# EasyEDA Pro project ProPrj_主控第一版_2024-07-22_15-28-46_2024-09-27.epro

# Schematic Schematic1
Board Name: Board1
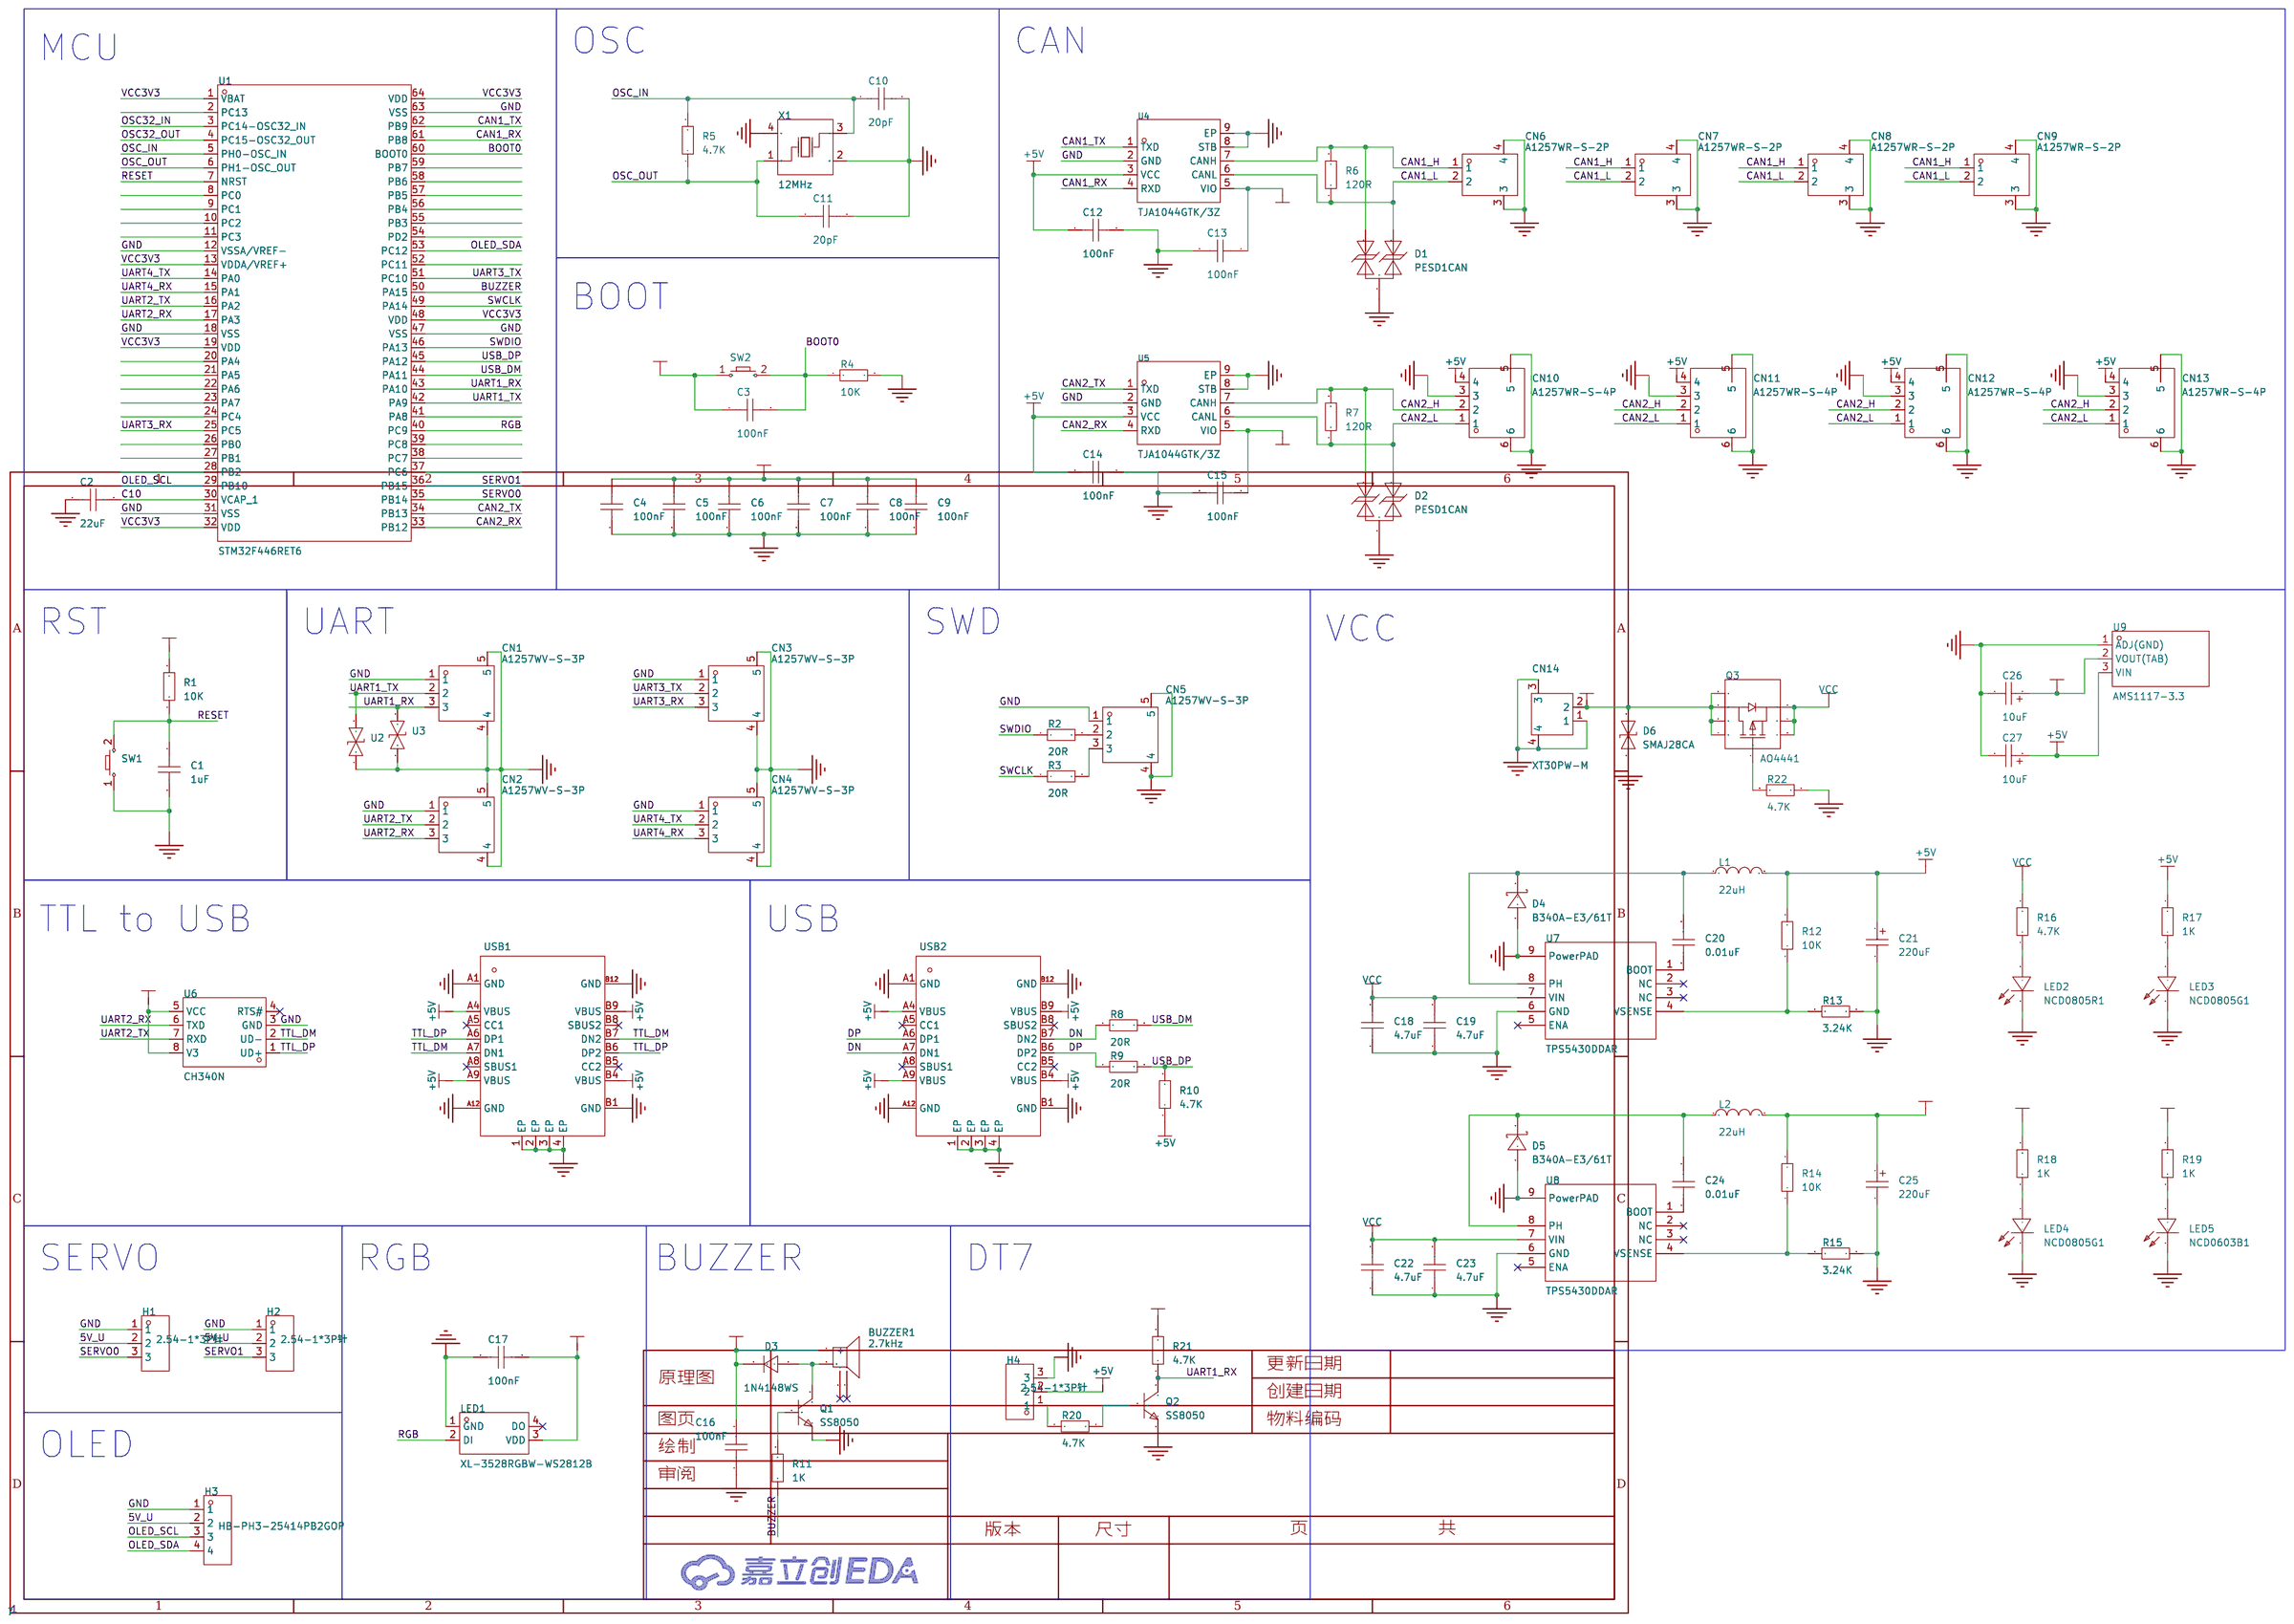
[diagram p0: schematic sheet]

## Parts
BUZZER1  2.7kHz  [BUZ-SMD_4P-L8.5-W8.5-P8.50-BR]
C1  1uF  [C0603]
C2  22uF  [C0603]
C3  100nF  [C0603]
C4  100nF  [C0603]
C5  100nF  [C0603]
C6  100nF  [C0603]
C7  100nF  [C0603]
C8  100nF  [C0603]
C9  100nF  [C0603]
C10  20pF  [C0603]
C11  20pF  [C0603]
C12  100nF  [C0603]
C13  100nF  [C0603]
C14  100nF  [C0603]
C15  100nF  [C0603]
C16  100nF  [C0603]
C17  100nF  [C0603]
C18  4.7uF  [C0603]
C19  4.7uF  [C0603]
C20  0.01uF  [C0603]
C21  220uF  [C_Ele_SMD_3x5.4mm]
C22  4.7uF  [C0603]
C23  4.7uF  [C0603]
C24  0.01uF  [C0603]
C25  220uF  [C_Ele_SMD_3x5.4mm]
C26  10uF  [C_Ele_SMD_3x5.4mm]
C27  10uF  [C_Ele_SMD_3x5.4mm]
CN1  A1257WV-S-3P  [CONN-SMD_A1257WV-S-3P]
CN2  A1257WV-S-3P  [CONN-SMD_A1257WV-S-3P]
CN3  A1257WV-S-3P  [CONN-SMD_A1257WV-S-3P]
CN4  A1257WV-S-3P  [CONN-SMD_A1257WV-S-3P]
CN5  A1257WV-S-3P  [CONN-SMD_A1257WV-S-3P]
CN6  A1257WR-S-2P  [CONN-SMD_A1257WR-S-2P]
CN7  A1257WR-S-2P  [CONN-SMD_A1257WR-S-2P]
CN8  A1257WR-S-2P  [CONN-SMD_A1257WR-S-2P]
CN9  A1257WR-S-2P  [CONN-SMD_A1257WR-S-2P]
CN10  A1257WR-S-4P  [CONN-SMD_A1257WR-S-4P]
CN11  A1257WR-S-4P  [CONN-SMD_A1257WR-S-4P]
CN12  A1257WR-S-4P  [CONN-SMD_A1257WR-S-4P]
CN13  A1257WR-S-4P  [CONN-SMD_A1257WR-S-4P]
CN14  XT30PW-M  [CONN-TH_XT30PW-M]
D1  PESD1CAN  [SOT-23-3_L2.9-W1.6-P1.90-LS2.8-BR]
D2  PESD1CAN  [SOT-23-3_L2.9-W1.6-P1.90-LS2.8-BR]
D3  1N4148WS  [SOD-323_L1.8-W1.3-LS2.5-RD]
D4  B340A-E3/61T  [SMA_L4.3-W2.6-LS5.2-RD]
D5  B340A-E3/61T  [SMA_L4.3-W2.6-LS5.2-RD]
D6  SMAJ28CA  [SMA_L4.4-W2.6-LS5.0-BI]
H1  2.54-1*3P针  [HDR-TH_3P-P2.54-V-M-1]
H2  2.54-1*3P针  [HDR-TH_3P-P2.54-V-M-1]
H3  HB-PH3-25414PB2GOP  [HDR-TH_4P-P2.54-V-M]
H4  2.54-1*3P针  [HDR-TH_3P-P2.54-V-M-1]
L1  22uH  [L0603]
L2  22uH  [L0603]
LED1  XL-3528RGBW-WS2812B  [LED-SMD_4P-L3.5-W2.8-BR-1]
LED2  NCD0805R1  [LED0805-R-RD]
LED3  NCD0805G1  [LED0805-R-RD]
LED4  NCD0805G1  [LED0805-R-RD]
LED5  NCD0603B1  [LED0603-RD]
Q1  SS8050  [SOT-23-3_L2.9-W1.3-P1.90-LS2.4-BR]
Q2  SS8050  [SOT-23-3_L2.9-W1.3-P1.90-LS2.4-BR]
Q3  AO4441  [SOIC-8_L4.9-W3.9-P1.27-LS6.0-BL]
R1  10K  [R0603]
R2  20R  [R0603]
R3  20R  [R0603]
R4  10K  [R0603]
R5  4.7K  [R0603]
R6  120R  [R0603]
R7  120R  [R0603]
R8  20R  [R0603]
R9  20R  [R0603]
R10  4.7K  [R0603]
R11  1K  [R0603]
R12  10K  [R0603]
R13  3.24K  [R0603]
R14  10K  [R0603]
R15  3.24K  [R0603]
R16  4.7K  [R0603]
R17  1K  [R0603]
R18  1K  [R0603]
R19  1K  [R0603]
R20  4.7K  [R0603]
R21  4.7K  [R0603]
R22  4.7K  [R0603]
SW1  -  [Key_SMD_3x4x2]
SW2  -  [Key_SMD_3x4x2]
U1  STM32F446RET6  [LQFP-64_L10.0-W10.0-P0.50-LS12.0-BL]
U2  ESD9B5.0ST5G  [SOD-923_L0.8-W0.6-LS1.0-BI]
U3  ESD9B5.0ST5G  [SOD-923_L0.8-W0.6-LS1.0-BI]
U4  TJA1044GTK/3Z  [HVSON-8_L3.0-W3.0-P0.65-BL-EP]
U5  TJA1044GTK/3Z  [HVSON-8_L3.0-W3.0-P0.65-BL-EP]
U6  CH340N  [SOP-8_L4.9-W3.9-P1.27-LS6.0-BL]
U7  TPS5430DDAR  [ESOP-8_L4.9-W3.9-P1.27-LS6.0-TL-EP]
U8  TPS5430DDAR  [ESOP-8_L4.9-W3.9-P1.27-LS6.0-TL-EP]
U9  AMS1117-3.3  [SOT-89_L4.5-W2.5-P1.50-LS4.2-BR]
USB1  -  [USB_TYPE-C-16P]
USB2  -  [USB_TYPE-C-16P]
X1  12MHz  [OSC-SMD_4P-L3.2-W2.5-BL]

## Library data of the parts
BUZZER1 = MLT-8530_C94599: 驱动方式:无源(外部驱动);构造类型:电磁式;频率:2.7kHz;声压(SPL):80dB@5V,10cm;; LCSC Part Name: MLT-8530; Supplier Part: C94599; Manufacturer: 华能; Manufacturer Part: MLT-8530; Supplier Footprint: SMD,8.5x8.5mm; JLCPCB Part Class: 扩展库; Datasheet: https://atta.szlcsc.com/upload/public/pdf/source/20170522/1495448322339.pdf; Supplier: LCSC; Oscillator Circuit: 无源(外部驱动); Technology Type: 电磁式; Operating Voltage: 2.5V~4.5V; Sound Pressure Level (SPL): 80dB@5V,10cm; Length: 8.5mm; Width: 8.5mm; Height: 3.3mm
C1-C20 C22-C24 = CAP_0603: Supplier Footprint: 0603
C21 C25-C27 = C_Ele_SMD_3x5.4mm: Supplier Footprint: SMD,3x5.4mm
CN1-CN5 = A1257WV-S-3P: 插针结构:1x3P;间距:1.25mm;安装方式:-;参考系列:GH;总PIN数:3P;排数:1;每排PIN数:3;行距:-;触头材质:黄铜;; LCSC Part Name: 系列:GH 间距:1.25mm 1x3P; Supplier Part: C225119; Manufacturer: CJT(长江连接器); Supplier Footprint: SMD,P=1.25mm; JLCPCB Part Class: 扩展库; Datasheet: https://atta.szlcsc.com/upload/public/pdf/source/20181008/C272994_C9E89FA8A36D0009CAD30AD8C59C2782.pdf; Supplier: LCSC; Pins Structure: 1x3P; Pitch: 1.25mm; Reference Series: GH; Number of Pins: 3P; Number of Rows: 1; Number of PINs Per Row: 3; Contact Material: 黄铜
CN6-CN9 = A1257WR-S-2P: 插针结构:1x2P;间距:1.25mm;安装方式:-;参考系列:GH;总PIN数:2P;排数:1;每排PIN数:2;行距:-;触头材质:黄铜;; LCSC Part Name: 系列:GH 间距:1.25mm 1x2P; Supplier Part: C225125; Manufacturer: CJT(长江连接器); Supplier Footprint: SMD,P=1.25mm,卧贴; JLCPCB Part Class: 扩展库; Datasheet: https://atta.szlcsc.com/upload/public/pdf/source/20181008/C272994_C9E89FA8A36D0009CAD30AD8C59C2782.pdf; Supplier: LCSC; Pins Structure: 1x2P; Pitch: 1.25mm; Reference Series: GH; Number of Pins: 2P; Number of Rows: 1; Number of PINs Per Row: 2; Contact Material: 黄铜
CN10-CN13 = A1257WR-S-4P: 插针结构:1x4P;间距:1.25mm;安装方式:-;参考系列:GH;总PIN数:4P;排数:1;每排PIN数:4;行距:-;触头材质:黄铜;; LCSC Part Name: 系列:GH 间距:1.25mm 1x4P; Supplier Part: C225127; Manufacturer: CJT(长江连接器); Supplier Footprint: SMD,P=1.25mm,卧贴; JLCPCB Part Class: 扩展库; Datasheet: https://atta.szlcsc.com/upload/public/pdf/source/20181008/C272994_C9E89FA8A36D0009CAD30AD8C59C2782.pdf; Supplier: LCSC; Pins Structure: 1x4P; Pitch: 1.25mm; Reference Series: GH; Number of Pins: 4P; Number of Rows: 1; Number of PINs Per Row: 4; Contact Material: 黄铜
CN14 = XT30PW-M: 类别:-;类型1:-;; LCSC Part Name: AMASS(艾迈斯)航模插头 卧式弯脚 XT30PW-M公头; Supplier Part: C431092; Manufacturer: AMASS(艾迈斯); JLCPCB Part Class: 扩展库; Datasheet: https://atta.szlcsc.com/upload/public/pdf/source/20220222/6A9F22F7850E25B33E1BE430ADF8560B.pdf; Supplier: LCSC; Brand: 艾迈斯; Type: 航模插头; RatedVoltage: DC 500V; InterfaceType: 公头; RatedCurrent: 15A; RecommendedWireGauge: 16/18/20AWG; contact resistance: 1.2mΩ; specifications: 2pin
D1 D2 = PESD1CAN_C343993: 极性:双向;反向截止电压(Vrwm):24V;最大钳位电压:48V;峰值脉冲电流(Ipp)@10/1000us:6A;击穿电压:26.7V;; LCSC Part Name: 双向ESD; Supplier Part: C343993; Manufacturer: BORN(伯恩半导体); Supplier Footprint: SOT-23; JLCPCB Part Class: 扩展库; Datasheet: https://atta.szlcsc.com/upload/public/pdf/source/20181211/C343993_AF595724ADB82F42A1C256C97FD7AD6B.pdf; Supplier: LCSC; polarity: 双向; Reverse Stand-Off Voltage (Vrwm): 24V; Maximum Clamping Voltage: 48V; Peak Pulse Current (Ipp)@10/1000us: 6A; Breakdown Voltage: 26.7V; Type: ESD
D3 = 1N4148WS_C2128: 二极管配置:独立式;正向压降(Vf):1.25V@150mA;直流反向耐压(Vr):100V;平均整流电流(Io):150mA;功率:200mW;反向恢复时间(trr):4ns;; LCSC Part Name: 电压:100V 电流:150mA; Supplier Part: C2128; Manufacturer: CJ(江苏长电/长晶); Supplier Footprint: SOD-323; JLCPCB Part Class: 基础库; Datasheet: https://atta.szlcsc.com/upload/public/pdf/source/20140809/1457707208178.pdf; Supplier: LCSC; Diode Configuration: 独立式; Forward Voltage (Vf@If): 1.25V@150mA; Reverse Voltage (Vr): 100V; Average Rectified Current (Io): 150mA; Power Dissipation: 200mW; Reverse Leakage Current: 1uA@75V; Reverse Recovery Time (trr): 4ns
D4 D5 = B340A-E3/61T: 正向压降(Vf):550mV@3A;直流反向耐压(Vr):40V;平均整流电流(Io):3A;; LCSC Part Name: 电压:40V 电流:3A; Supplier Part: C15570; Manufacturer: VISHAY(威世); Supplier Footprint: SMA(DO-214AC); JLCPCB Part Class: 扩展库; Datasheet: https://atta.szlcsc.com/upload/public/pdf/source/20130720/1457706624701.pdf; Supplier: LCSC; Forward Voltage (Vf@If): 550mV@3A; Reverse Voltage (Vr): 40V; Average Rectified Current (Io): 3A; Reverse Leakage Current (Ir): 500uA@40V
D6 = SMAJ28CA_C148228: 反向截止电压(Vrwm):28V;最大钳位电压:45.4V;峰值脉冲电流(Ipp)@10/1000us:8.8A;峰值脉冲功率(Ppp)@10/1000us:400W;击穿电压:31.1V;; LCSC Part Name: 双向TVS 28V截止 8.8A峰值脉冲; Supplier Part: C148228; Manufacturer: Littelfuse(美国力特); Supplier Footprint: SMA(DO-214AC); JLCPCB Part Class: 扩展库; Datasheet: https://atta.szlcsc.com/upload/public/pdf/source/20190402/C374025_5ACE77BC72947DF13CF0CBC7F8B57228.pdf; Supplier: LCSC; Reverse Stand-Off Voltage (Vrwm): 28V; Maximum Clamping Voltage: 45.4V; Peak Pulse Current (Ipp)@10/1000us: 8.8A; Peak Pulse Power Dissipation (Ppp)@10/1000us: 400W; Breakdown Voltage: 31.1V; Type: TVS
H1 H2 H4 = 2.54-1*3P针: 插针结构:1x3P;间距:2.54mm;行距:-;圆针/方针:方针;安装类型:直插;排数:单排;总PIN位数:3P;额定电流:3A;额定电压:-;配合针长度:-;塑高:-;端接针长度:-;触头材质:-;触头镀层:-;工作温度范围:-40℃~+105℃;颜色:黑色;; LCSC Part Name: 间距:2.54mm 1x3P 直插 方针; Supplier Part: C49257; Manufacturer: BOOMELE(博穆精密); Supplier Footprint: 插件,P=2.54mm; JLCPCB Part Class: Extended Part; Datasheet: https://atta.szlcsc.com/upload/public/pdf/source/20221018/3E9408392E35E6F57A28985E5F7BF5C9.pdf; Supplier: LCSC; Pin Structure: 1x3P; Pitch: 2.54mm; Circluar Pins/Square Pins: 方针; Mounting Type: 直插; Number of Rows: 单排; Number of Pins: 3P; Current Rating (Max): 3A; Operating Temperature Range: -40℃~+105℃; Color: 黑色
H3 = HB-PH3-25414PB2GOP: 插针结构:1x4P;间距:2.54mm;行距:2.54mm;圆针/方针:方针;安装类型:直插;排数:单排;总PIN位数:4P;额定电流:3A;额定电压:250V;配合针长度:6mm;塑高:2.54mm;端接针长度:3mm;触头材质:黄铜;触头镀层:金;工作温度范围:-40℃~+105℃;焊接温度(最大值):260℃;颜色:黑色;; LCSC Part Name: 间距:2.54mm 1x4P 直插 方针; Supplier Part: C6332197; Manufacturer: HANBO(汉博); Supplier Footprint: 插件,P=2.54mm; JLCPCB Part Class: Extended Part; Datasheet: https://atta.szlcsc.com/upload/public/pdf/source/20230803/F72D259687963761DF1B552F3BB84A31.pdf; Supplier: LCSC; Pin Structure: 1x4P; Pitch: 2.54mm; Row Spacing: 2.54mm; Circluar Pins/Square Pins: 方针; Mounting Type: 直插; Number of Rows: 单排; Number of Pins: 4P; Current Rating (Max): 3A; Voltage Rating (Max): 250V; Length of Mating Pin: 6mm; Insulation Height: 2.54mm; Length of End Connection Pin: 3mm; Contact Material: 黄铜; Contact Plating: 金; Operating Temperature Range: -40℃~+105℃; Soldering Temperature(Max): 260℃; Color: 黑色
L1 L2 = L_0603
LED1 = XL-3528RGBW-WS2812B: 3528 七彩幻彩雾状 ws2812B 内置驱动IC; Supplier Part: C2890364; Manufacturer: XINGLIGHT(成兴光); Supplier Footprint: SMD3528-4P; JLCPCB Part Class: 扩展库; Datasheet: https://atta.szlcsc.com/upload/public/pdf/source/20240218/041E1E0D0024617DFFF124D9C311BB4D.pdf; Supplier: LCSC
LED2 = NCD0805R1: 灯头类型:-;发光颜色:红色;正向电压(VF):1.6V~2.6V;功率:65mW;正向电流:20mA;主波长:615nm~630nm;二极管配置:独立二极管;透镜颜色:无色透明透镜;色温:-;发光强度:67mcd~195mcd;发光角度:130°;载带方式:-;工作温度:-30℃~+85℃;; Supplier Part: C84256; Manufacturer: 国星光电; Supplier Footprint: 0805; JLCPCB Part Class: 基础库; Datasheet: https://atta.szlcsc.com/upload/public/pdf/source/20200820/C84256_F0A75A43B3EAD75808600A0514C76B99.pdf; Supplier: LCSC; Emitted Color: 红色; Forward Voltage (VF): 1.6V~2.6V; Power Dissipation: 65mW; Forward Current: 20mA; Dominant Wavelength: 615nm~630nm; Diode Configuration: 独立二极管; Lens Color: 无色透明透镜; Luminous Intensity: 67mcd~195mcd; Viewing Angle: 130°; Operating Temperature: -30℃~+85℃
LED3 LED4 = NCD0805G1: 发光颜色:翠绿色;正向电压(VF):2.5V~3.6V;功率:72mW;正向电流:5mA;主波长:525nm~537.5nm;透镜颜色:无色透明透镜;发光强度:180mcd~400mcd;发光角度:130°;工作温度:-30℃~+85℃;; Supplier Part: C84260; Manufacturer: 国星光电; Supplier Footprint: 0805; JLCPCB Part Class: Extended Part; Datasheet: https://atta.szlcsc.com/upload/public/pdf/source/20200820/C84260_AFC7BF57C6FBA034D182BB8D10A67EFE.pdf; Supplier: LCSC; Emitted Color: 翠绿色; Forward Voltage (VF): 2.5V~3.6V; Power Dissipation: 72mW; Forward Current: 5mA; Dominant Wavelength: 525nm~537.5nm; Lens Color: 无色透明透镜; Luminous Intensity: 180mcd~400mcd; Viewing Angle: 130°; Operating Temperature: -30℃~+85℃; Diode Configuration: 独立二极管
LED5 = NCD0603B1: 发光颜色:蓝色;正向电压(VF):2.6V~3.6V;功率:72mW;正向电流:10mA;主波长:463nm~475nm;透镜颜色:无色透明透镜;发光强度:80mcd~220mcd;发光角度:130°;工作温度:-30℃~+85℃;; Supplier Part: C84266; Manufacturer: 国星光电; Supplier Footprint: 0603; JLCPCB Part Class: Extended Part; Datasheet: https://atta.szlcsc.com/upload/public/pdf/source/20200820/C84266_6A3CDBEFA72C6CAD68EDA53474ADAE6C.pdf; Supplier: LCSC; Emitted Color: 蓝色; Forward Voltage (VF): 2.6V~3.6V; Power Dissipation: 72mW; Forward Current: 10mA; Dominant Wavelength: 463nm~475nm; Lens Color: 无色透明透镜; Luminous Intensity: 80mcd~220mcd; Viewing Angle: 130°; Operating Temperature: -30℃~+85℃; Diode Configuration: 独立二极管
Q1 Q2 = SS8050_C2150: 晶体管类型:NPN;集电极电流(Ic):1.5A;集射极击穿电压(Vceo):25V;功率(Pd):300mW;直流电流增益(hFE@Ic,Vce):200@100mA,1V;; LCSC Part Name: SS8050(RANGE:200-350) hfe=200~350; Supplier Part: C2150; Manufacturer: CJ(江苏长电/长晶); Supplier Footprint: SOT-23; JLCPCB Part Class: 基础库; Datasheet: https://atta.szlcsc.com/upload/public/pdf/source/20230322/AEE86F4B043774EFF80CAEA14A37D9E9.pdf; Supplier: LCSC; Transistor Type: NPN; Collector Current (Ic): 1.5A; Collector-Emitter Breakdown Voltage (Vceo): 25V; Power Dissipation (Pd): 300mW; DC Current Gain (hFE@Ic,Vce): 200@100mA,1V; Transition Frequency (fT): 100MHz; Collector Cut-Off Current (Icbo): 100nA; Collector-Emitter Saturation Voltage (VCE(sat)@Ic,Ib): 500mV@800mA,80mA
Q3 = AO4441_C22199: 类型:P沟道;漏源电压(Vdss):60V;连续漏极电流(Id):4A;功率(Pd):3.1W;导通电阻(RDS(on)@Vgs,Id):100mΩ@10V,4A;阈值电压(Vgs(th)@Id):3V@250uA;; LCSC Part Name: P沟道 耐压:60V 电流:4A; Supplier Part: C22199; Manufacturer: AOS; Supplier Footprint: SOIC-8; JLCPCB Part Class: 扩展库; Datasheet: https://atta.szlcsc.com/upload/public/pdf/source/20150518/1457707310050.pdf; Supplier: LCSC; Type: P沟道; Drain Source Voltage (Vdss): 60V; Continuous Drain Current (Id): 4A; Power Dissipation (Pd): 3.1W; Drain Source On Resistance (RDS(on)@Vgs,Id): 100mΩ@10V,4A; Gate Threshold Voltage (Vgs(th)@Id): 3V@250uA; Total Gate Charge (Qg@Vgs): 20nC@10V; Input Capacitance (Ciss@Vds): 1.12nF@30V; Operating Temperature: -55℃~+150℃@(Tj)
R1-R22 = Res_0603: Supplier Footprint: 0603
SW1 SW2 = Key_SMD_3x4x2: Supplier Footprint: SMD
U1 = STM32F446RET6: CPU内核:CM4;程序存储容量:512KB;RAM总容量:128KB;GPIO端口数量:50;工作电压范围:1.7V~3.6V;CPU最大主频:180MHz;程序存储器类型:FLASH;; LCSC Part Name: STM32F446RET6 MSL=3; Supplier Part: C69336; Manufacturer: ST(意法半导体); Supplier Footprint: LQFP-64(10x10); JLCPCB Part Class: 扩展库; Datasheet: https://atta.szlcsc.com/upload/public/pdf/source/20170518/1495086068896.pdf; Supplier: LCSC; CPU Core: CM4; Program Storage Size: 512KB; RAM Size: 128KB; GPIO Ports Number: 50; Operating Voltage Range: 1.7V~3.6V; CPU Maximum Speed: 180MHz; Program Memory Type: FLASH; Operating Temperature Range: -40℃~+85℃; ADC (Bit): 12bit; DAC (Bit): 12bit; Universal Serial Bus: 有; Peripheral/Function: PWM；PWM；低电压检测; Watchdog: 有; Infrared Data Association: 有; Low-Voltage Detect: 有; Direct Memory Access: 有; Internal Oscillator: 有
U2 U3 = ESD9B5.0ST5G_C3021104: Supplier Part: C3021104; Manufacturer: TECH PUBLIC(台舟); Supplier Footprint: SOD-923; JLCPCB Part Class: 扩展库; Datasheet: https://atta.szlcsc.com/upload/public/pdf/source/20220524/6CC5EA9A5BA15BBB56040E503B840966.pdf; Supplier: LCSC
U4 U5 = TJA1044GTK/3Z: 类型:-;; Supplier Part: C2157795; Manufacturer: NXP(恩智浦); Supplier Footprint: HVSON-8-EP(3x3); JLCPCB Part Class: 扩展库; Datasheet: https://atta.szlcsc.com/upload/public/pdf/source/20180227/C181725_15196977259441370130.pdf; Supplier: LCSC
U6 = CH340N: LCSC Part Name: USB转串口芯片 CH340; Supplier Part: C2977777; Manufacturer: WCH(南京沁恒); Supplier Footprint: SOP-8; JLCPCB Part Class: 扩展库; Datasheet: https://atta.szlcsc.com/upload/public/pdf/source/20230530/6E401E9554E9F5311886CC8B3F89B62E.pdf; Supplier: LCSC
U7 U8 = TPS5430DDAR: 功能类型:降压型;输出类型:可调;输入电压:5.5V~36V;输出电压:1.221V~32.04V;输出电流(最大值):3A;; LCSC Part Name: 降压 3A 36V; Supplier Part: C9864; Manufacturer: TI(德州仪器); Supplier Footprint: SOIC-8-EP; JLCPCB Part Class: 基础库; Datasheet: https://www.ti.com/cn/lit/gpn/tps5430; Supplier: LCSC; Function: 降压型; Output Type: 可调; Input Voltage: 5.5V~36V; Output Voltage: 1.221V~32.04V; Output Current (Max): 3A; Switching Frequency: 500kHz; Operating Temperature: -40℃~+125℃@(TJ); Synchronous Rectification: 否; Number of Outputs: 1; Topology: 降压式; Switch tube (built-in/external): 内置
U9 = AMS1117-3.3_C347256: 输出类型:固定;最大输入电压:12V;输出电压:3.3V;最大输出电流:1A;电源纹波抑制比(PSRR):60dB@(120Hz);输出极性:正极;; LCSC Part Name: 输出:3.3V 电流:1A 耐压:12V; Supplier Part: C347256; Manufacturer: UMW(友台半导体); Supplier Footprint: SOT-89; JLCPCB Part Class: 扩展库; Datasheet: https://atta.szlcsc.com/upload/public/pdf/source/20231109/155D79A26D9DB04352555A58D5969DC8.pdf; Supplier: LCSC; Output Type: 固定; Maximum Input Voltage: 12V; Output Voltage: 3.3V; MAX Output Current: 1A; Power Supply Rejection Ratio (PSRR): 60dB@(120Hz); Dropout Voltage: 1.3V@(1A); Output Polarity: 正极; Number of Outputs: 1
USB1 USB2 = USB_TYPE-C-16P: Supplier Footprint: SMD
X1 = X322512MSB4SI: 晶振类型:贴片晶振;频率:12MHz;常温频差:±10ppm;外接负载电容:20pF;频率稳定度(全温):±20ppm;; LCSC Part Name: 12MHz ±10ppm 20pF; Supplier Part: C9002; Manufacturer: YXC(扬兴晶振); Supplier Footprint: SMD3225-4P; JLCPCB Part Class: 基础库; Datasheet: https://atta.szlcsc.com/upload/public/pdf/source/20240329/19D5F850207469550BEB00D7DFEDBC7A.pdf; Supplier: LCSC; Crystal Type: 贴片晶振; Normal temperature Frequency Tolerance: ±10ppm; External load capacitor: 20pF; Frequency Stability(Full temperature range): ±20ppm; Operating Temperature: -40℃~+85℃

## Nets
5V_U: C25.1 H1.2 H2.2 H3.2 L2.2 R14.2 R18.2
+5V: C12.2 C14.2 C21.1 C27.1 CN10.4 CN11.4 CN12.4 CN13.4 H4.2 L1.2 R10.1 R12.2 R17.2 U4.3(VCC) U5.3(VCC) U9.3(VIN) USB1.A4(VBUS) USB1.A9(VBUS) USB1.B4(VBUS) USB1.B9(VBUS) USB2.A4(VBUS) USB2.A9(VBUS) USB2.B4(VBUS) USB2.B9(VBUS)
GND: C1.2 C2.1 C4.1 C5.1 C6.1 C7.1 C8.1 C9.1 C10.2 C11.2 C12.1 C13.2 C14.1 C15.2 C16.1 C17.1 C18.1 C19.1 C21.2 C22.1 C23.1 C25.2 C26.2 C27.2 CN1.1 CN1.4 CN1.5 CN2.1 CN2.4 CN2.5 CN3.1 CN3.4 CN3.5 CN4.1 CN4.4 CN4.5 CN5.1 CN5.4 CN5.5 CN6.3 CN6.4 CN7.3 CN7.4 CN8.3 CN8.4 CN9.3 CN9.4 CN10.3 CN10.5 CN10.6 CN11.3 CN11.5 CN11.6 CN12.3 CN12.5 CN12.6 CN13.3 CN13.5 CN13.6 CN14.1 CN14.3 CN14.4 D1.3(A) D2.3(A) D4.2(A) D5.2(A) D6.1 H1.1 H2.1 H3.1 H4.3 LED1.1(GND) LED2.2(-) LED3.2(-) LED4.2(-) LED5.2(-) Q1.2(E) Q2.2(E) R4.2 R13.1 R15.1 R22.1 SW1.1 U1.12(VSSA/VREF-) U1.18(VSS) U1.31(VSS) U1.47(VSS) U1.63(VSS) U2.1 U3.1 U4.2(GND) U4.8(STB) U4.9(EP) U5.2(GND) U5.8(STB) U5.9(EP) U6.3(GND) U7.6(GND) U7.9(PowerPAD) U8.6(GND) U8.9(PowerPAD) U9.1(ADJ(GND)) USB1.1(EP) USB1.2(EP) USB1.3(EP) USB1.4(EP) USB1.A1(GND) USB1.A12(GND) USB1.B1(GND) USB1.B12(GND) USB2.1(EP) USB2.2(EP) USB2.3(EP) USB2.4(EP) USB2.A1(GND) USB2.A12(GND) USB2.B1(GND) USB2.B12(GND) X1.2(GND) X1.4(GND)
VCC: C18.2 C19.2 C22.2 C23.2 Q3.1(S) Q3.2(S) Q3.3(S) R16.2 U7.7(VIN) U8.7(VIN)
VCC3V3: BUZZER1.1(+) C3.1 C4.2 C5.2 C6.2 C7.2 C8.2 C9.2 C13.1 C15.1 C16.2 C17.2 C26.1 D3.1(K) LED1.3(VDD) R1.2 R19.2 R21.2 SW2.1 U1.1(VBAT) U1.13(VDDA/VREF+) U1.19(VDD) U1.32(VDD) U1.48(VDD) U1.64(VDD) U4.5(VIO) U5.5(VIO) U6.5(VCC) U6.8(V3) U9.2(VOUT(TAB))
BAT: CN14.2 D6.2 Q3.5(D) Q3.6(D) Q3.7(D) Q3.8(D)
BOOT0: C3.2 R4.1 SW2.2 U1.60(BOOT0)
BUZZER: R11.1 U1.50(PA15)
C10: C2.2 U1.30(VCAP_1)
CAN1_H: CN6.1 CN7.1 CN8.1 CN9.1 D1.2(K) R6.2 U4.7(CANH)
CAN1_L: CN6.2 CN7.2 CN8.2 CN9.2 D1.1(K) R6.1 U4.6(CANL)
CAN1_RX: U1.61(PB8) U4.4(RXD)
CAN1_TX: U1.62(PB9) U4.1(TXD)
CAN2_H: CN10.2 CN11.2 CN12.2 CN13.2 D2.2(K) R7.2 U5.7(CANH)
CAN2_L: CN10.1 CN11.1 CN12.1 CN13.1 D2.1(K) R7.1 U5.6(CANL)
CAN2_RX: U1.33(PB12) U5.4(RXD)
CAN2_TX: U1.34(PB13) U5.1(TXD)
DN: R8.1 USB2.A7(DN1) USB2.B7(DN2)
DP: R9.1 USB2.A6(DP1) USB2.B6(DP2)
OLED_SCL: H3.3 U1.29(PB10)
OLED_SDA: H3.4 U1.53(PC12)
OSC32_IN: U1.3(PC14-OSC32_IN)
OSC32_OUT: U1.4(PC15-OSC32_OUT)
OSC_IN: C10.1 R5.2 U1.5(PH0-OSC_IN) X1.3(OSC2)
OSC_OUT: C11.1 R5.1 U1.6(PH1-OSC_OUT) X1.1(OSC1)
RESET: C1.1 R1.1 SW1.2 U1.7(NRST)
RGB: LED1.2(DI) U1.40(PC9)
SERVO0: H1.3 U1.35(PB14)
SERVO1: H2.3 U1.36(PB15)
SWCLK: R3.1 U1.49(PA14)
SWDIO: R2.1 U1.46(PA13)
TTL_DM: U6.2(UD-) USB1.A7(DN1) USB1.B7(DN2)
TTL_DP: U6.1(UD+) USB1.A6(DP1) USB1.B6(DP2)
UART1_RX: CN1.3 Q2.3(C) R21.1 U1.43(PA10) U3.2
UART1_TX: CN1.2 U1.42(PA9) U2.2
UART2_RX: CN2.3 U1.17(PA3) U6.6(TXD)
UART2_TX: CN2.2 U1.16(PA2) U6.7(RXD)
UART3_RX: CN3.3 U1.25(PC5)
UART3_TX: CN3.2 U1.51(PC10)
UART4_RX: CN4.3 U1.15(PA1)
UART4_TX: CN4.2 U1.14(PA0)
USB_DM: R8.2 U1.44(PA11)
USB_DP: R9.2 R10.2 U1.45(PA12)
$1N8795: BUZZER1.2 D3.2(A) Q1.3(C)
$1N9041: Q1.1(B) R11.2
$1N16702: C20.1 U7.1(BOOT)
$1N16722: C20.2 D4.1(K) L1.1 U7.8(PH)
$1N17094: R12.1 R13.2 U7.4(VSENSE)
$1N17486: C24.1 U8.1(BOOT)
$1N17488: C24.2 D5.1(K) L2.1 U8.8(PH)
$1N17512: R14.1 R15.2 U8.4(VSENSE)
$1N17679: LED2.1(+) R16.1
$1N17858: LED3.1(+) R17.1
$1N20132: LED4.1(+) R18.1
$1N20230: LED5.1(+) R19.1
$1N21122: Q2.1(B) R20.2
$1N21124: H4.1 R20.1
$1N24808: Q3.4(G) R22.2
Net-(CN5-2): CN5.2 R2.2
Net-(CN5-3): CN5.3 R3.2

Not connected (* = marked no-connect by the designer): BUZZER1 3* 4*; LED1 4(DO)*; U1 2(PC13) 8(PC0) 9(PC1) 10(PC2) 11(PC3) 20(PA4) 21(PA5) 22(PA6) 23(PA7) 24(PC4) 26(PB0) 27(PB1) 28(PB2) 37(PC6) 38(PC7) 39(PC8) 41(PA8) 52(PC11) 54(PD2) 55(PB3) 56(PB4) 57(PB5) 58(PB6) 59(PB7); U6 4(RTS#)*; U7 2(NC)* 3(NC)* 5(ENA)*; U8 2(NC)* 3(NC)* 5(ENA)*; USB1 A5(CC1)* A8(SBUS1)* B5(CC2)* B8(SBUS2)*; USB2 A5(CC1)* A8(SBUS1)* B5(CC2)* B8(SBUS2)*

## Notes on the sheet
- MCU
- OSC
- CAN
- BOOT
- RST
- UART
- SWD
- VCC
- TTL to USB
- USB
- SERVO
- RGB
- BUZZER
- DT7
- OLED

# Board PCB1
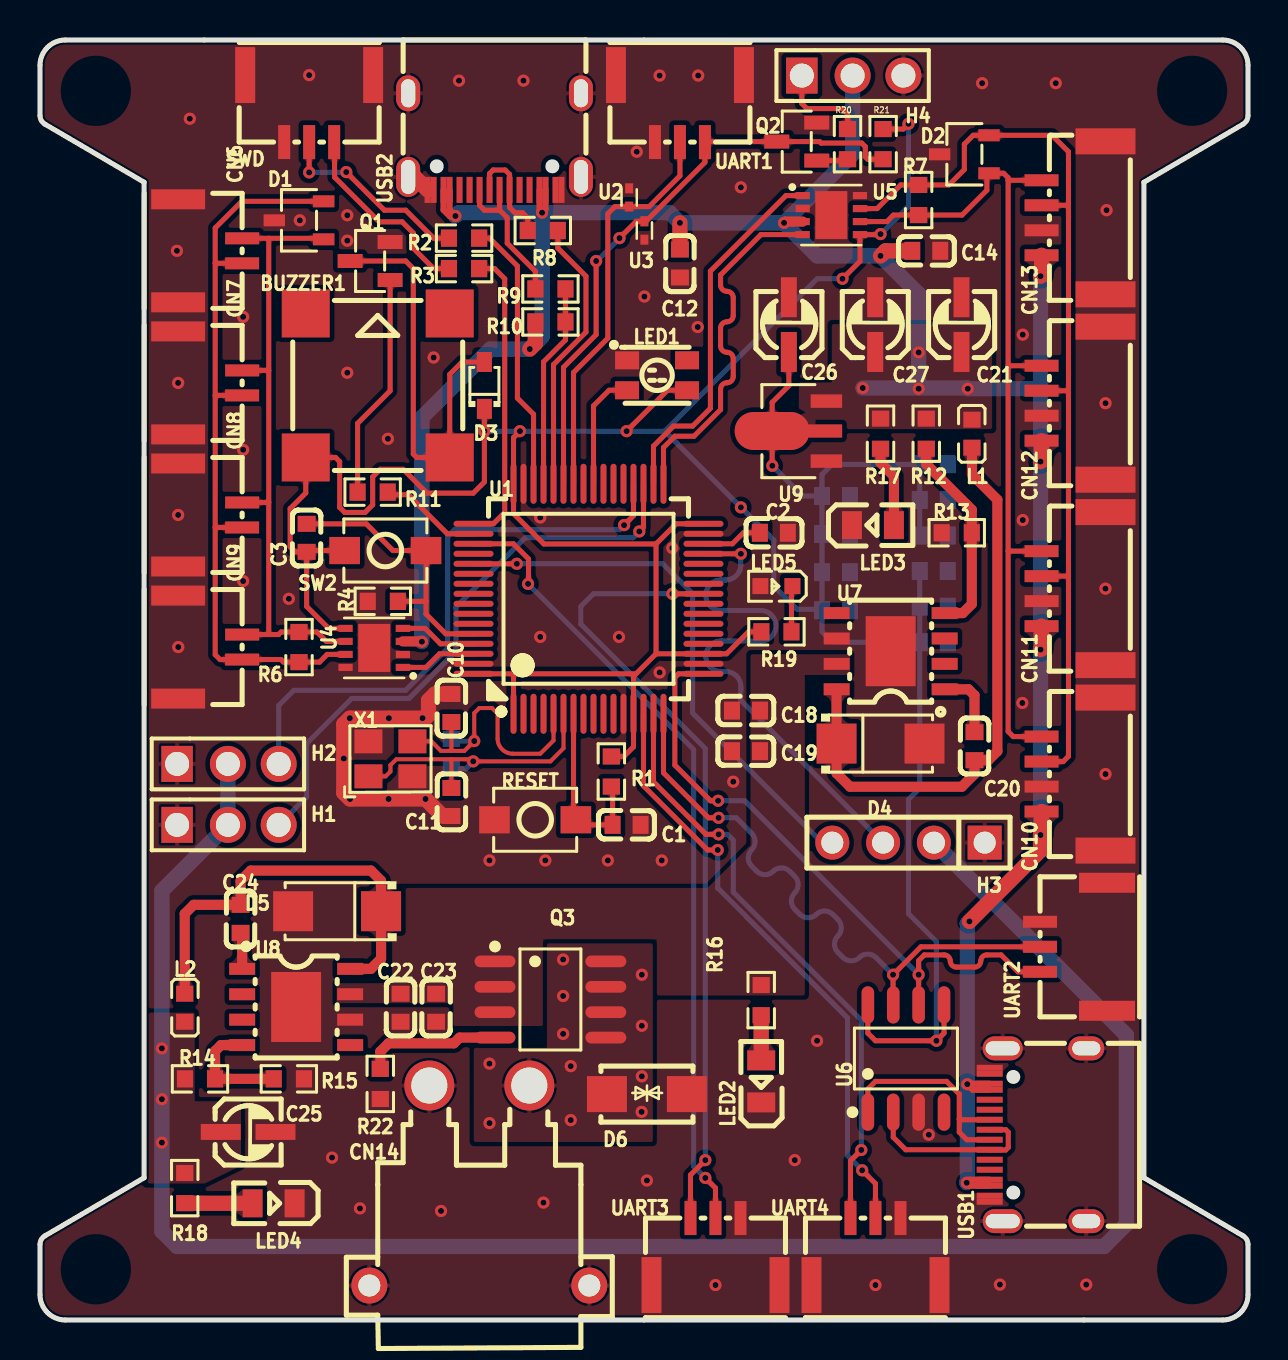
[diagram p1: board, top side]
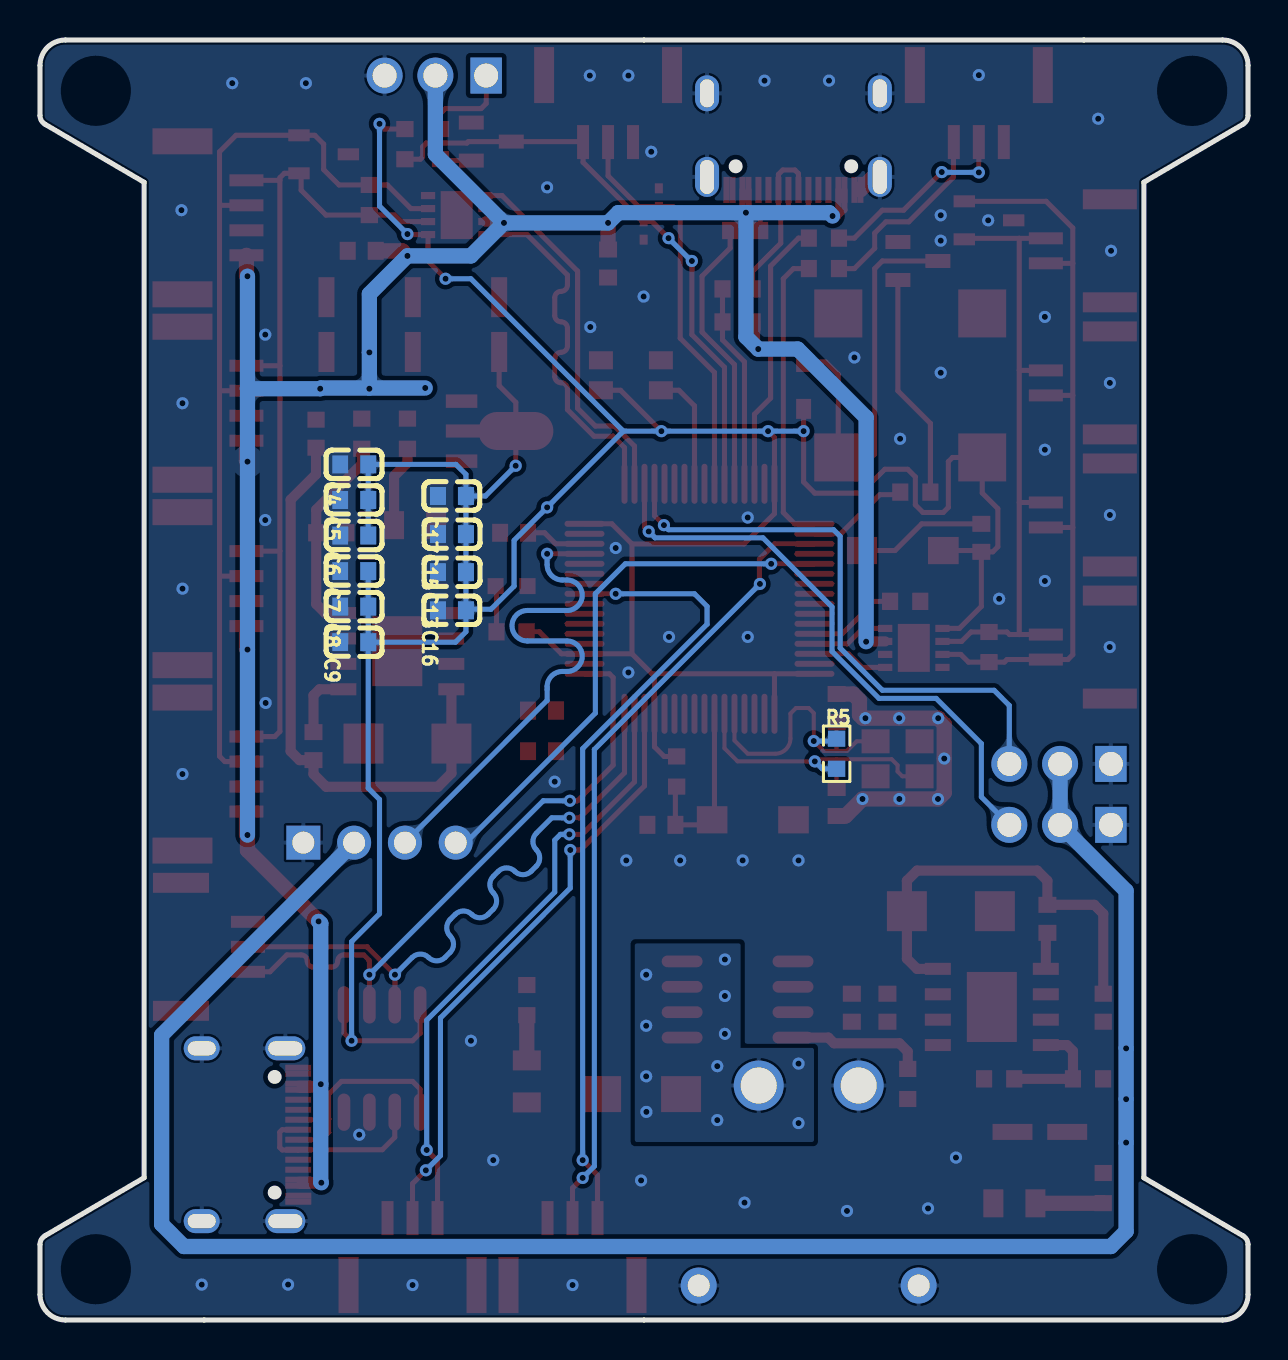
[diagram p2: board, bottom side, seen from below]

Outline 60.41 x 64 mm; copper layers: Top Layer, Bottom Layer. Coordinates in mm from the lower left corner of the outline.
Outline path: 0,62.73 0,60.23 arc(0.07,59.97) 0.25,59.79 5.21,56.89 5.21,7.11 0.25,4.21 arc(0.07,4.03) 0,3.77 0,1.27 arc(0.37,0.37) 1.27,0 59.14,0 arc(60.04,0.37) 60.41,1.27 60.41,3.77 arc(60.35,4.03) 60.16,4.21 55.21,7.11 55.21,56.89 60.16,59.79 arc(60.35,59.97) 60.41,60.23 60.41,62.73 arc(60.04,63.63) 59.14,64 1.27,64 arc(0.37,63.63) 0,62.73
Stack: Top Layer 0.035mm / Dielectric1 1.51mm FR4 er 4.5 / Bottom Layer 0.035mm

## Design rules (mm)
net OSC_IN: OSC
net OSC_OUT: OSC
net UART2_TX: UART2
net UART2_RX: UART2
net UART3_TX:  UART3
net UART3_RX:  UART3
net UART4_TX:  UART4
net UART4_RX:  UART4
net SERVO0: SERVO
net SERVO1: SERVO
net OLED_SCL: OLED
net OLED_SDA: OLED
net CAN1_TX: CAN1
net CAN1_RX: CAN1
net CAN2_TX:  CAN2
net CAN2_RX:  CAN2
template: 自定义配置
spacing copperThickness1oz (default): track to track 0.102, other pairs 0.152 to 0.3
spacing copperThickness2oz: track to track 0.203, other pairs 0.152 to 0.3
track width copperThickness1oz (default): min 0.127, default 0.254, max 2.54
track width copperThickness2oz: min 0.203, default 0.254, max 2.54
differential pair differentialPair (default): width min 0.127, default 0.254, max 2.54; gap min 0.152, default 0.152
via viaSize (default): diameter min 0.5, default 0.61, max 10; hole min 0.3, default 0.305, max 6.299

## Placement (name value [footprint] x y rotation side)
BUZZER1  2.7kHz  [BUZ-SMD_4P-L8.5-W8.5-P8.50-BR]  16.89 46.73 0 top
C1  1uF  [C0603]  29.34 24.76 0 top
C2  22uF  [C0603]  36.7 39.36 180 top
C3  100nF  [C0603]  13.33 39.11 90 top
C4  100nF  [C0603]  44.7 42.78 180 bottom
C5  100nF  [C0603]  44.7 41 180 bottom
C6  100nF  [C0603]  44.7 39.22 180 bottom
C7  100nF  [C0603]  44.7 37.45 180 bottom
C8  100nF  [C0603]  44.7 35.67 180 bottom
C9  100nF  [C0603]  44.7 33.89 180 bottom
C10  20pF  [C0603]  20.57 30.6 90 top
C11  20pF  [C0603]  20.57 25.9 270 top
C12  100nF  [C0603]  32 52.82 90 top
C13  100nF  [C0603]  39.81 37.39 0 bottom
C14  100nF  [C0603]  44.32 53.46 180 top
C15  100nF  [C0603]  39.81 39.3 0 bottom
C16  100nF  [C0603]  39.81 35.49 180 bottom
C17  100nF  [C0603]  39.81 41.2 180 bottom
C18  4.7uF  [C0603]  35.31 30.47 0 top
C19  4.7uF  [C0603]  35.31 28.44 0 top
C20  0.01uF  [C0603]  46.74 28.69 270 top
C21  220uF  [C_Ele_SMD_3x5.4mm]  46.1 49.78 270 top
C22  4.7uF  [C0603]  18.03 15.61 90 top
C23  4.7uF  [C0603]  19.81 15.61 90 top
C24  0.01uF  [C0603]  10.03 20.06 90 top
C25  220uF  [C_Ele_SMD_3x5.4mm]  10.41 9.39 180 top
C26  10uF  [C_Ele_SMD_3x5.4mm]  37.46 49.78 270 top
C27  10uF  [C_Ele_SMD_3x5.4mm]  41.78 49.78 270 top
CN6  A1257WR-S-2P  [CONN-SMD_A1257WR-S-2P]  8.51 53.46 270 top
CN7  A1257WR-S-2P  [CONN-SMD_A1257WR-S-2P]  8.51 46.86 270 top
CN8  A1257WR-S-2P  [CONN-SMD_A1257WR-S-2P]  8.51 40.25 270 top
CN9  A1257WR-S-2P  [CONN-SMD_A1257WR-S-2P]  8.51 33.65 270 top
CN10  A1257WR-S-4P  [CONN-SMD_A1257WR-S-4P]  51.69 27.3 90 top
CN11  A1257WR-S-4P  [CONN-SMD_A1257WR-S-4P]  51.69 36.57 90 top
CN12  A1257WR-S-4P  [CONN-SMD_A1257WR-S-4P]  51.69 45.84 90 top
CN13  A1257WR-S-4P  [CONN-SMD_A1257WR-S-4P]  51.69 55.11 90 top
CN14  XT30PW-M  [CONN-TH_XT30PW-M]  21.97 6.72 0 top
D1  PESD1CAN  [SOT-23-3_L2.9-W1.6-P1.90-LS2.8-BR]  12.95 54.98 0 top
D2  PESD1CAN  [SOT-23-3_L2.9-W1.6-P1.90-LS2.8-BR]  46.23 58.28 0 top
D3  1N4148WS  [SOD-323_L1.8-W1.3-LS2.5-RD]  22.23 46.73 90 top
D4  B340A-E3/61T  [SMA_L4.3-W2.6-LS5.2-RD]  42.04 28.82 0 top
D5  B340A-E3/61T  [SMA_L4.3-W2.6-LS5.2-RD]  14.86 20.44 180 top
D6  SMAJ28CA  [SMA_L4.4-W2.6-LS5.0-BI]  30.35 11.3 180 top
H1  2.54-1*3P针  [HDR-TH_3P-P2.54-V-M-1]  9.4 24.76 0 top
H2  2.54-1*3P针  [HDR-TH_3P-P2.54-V-M-1]  9.4 27.81 0 top
H3  HB-PH3-25414PB2GOP  [HDR-TH_4P-P2.54-V-M]  43.43 23.87 180 top
H4  2.54-1*3P针  [HDR-TH_3P-P2.54-V-M-1]  40.64 62.22 0 top
L1  22uH  [L0603]  46.61 44.31 90 top
L2  22uH  [L0603]  7.24 15.61 270 top
LED1  XL-3528RGBW-WS2812B  [LED-SMD_4P-L3.5-W2.8-BR-1]  30.86 47.24 180 top
LED2  NCD0805R1  [LED0805-R-RD]  36.07 11.93 90 top
LED3  NCD0805G1  [LED0805-R-RD]  41.66 39.74 0 top
LED4  NCD0805G1  [LED0805-R-RD]  11.68 5.83 180 top
LED5  NCD0603B1  [LED0603-RD]  36.83 36.69 180 top
Q1  SS8050  [SOT-23-3_L2.9-W1.3-P1.90-LS2.4-BR]  16.51 52.95 0 top
Q2  SS8050  [SOT-23-3_L2.9-W1.3-P1.90-LS2.4-BR]  37.85 58.92 0 top
Q3  AO4441  [SOIC-8_L4.9-W3.9-P1.27-LS6.0-BL]  25.53 16.03 270 top
R1  10K  [R0603]  28.58 27.42 90 top
R2  20R  [R0603]  21.21 54.09 180 top
R3  20R  [R0603]  21.21 52.57 180 top
R4  10K  [R0603]  17.14 35.93 180 top
R5  4.7K  [R0603]  20.57 28.31 90 bottom
R6  120R  [R0603]  12.95 33.65 270 top
R7  120R  [R0603]  43.94 56 90 top
R8  20R  [R0603]  25.15 54.47 0 top
R9  20R  [R0603]  25.53 51.55 0 top
R10  4.7K  [R0603]  25.53 49.9 0 top
R11  1K  [R0603]  16.64 41.39 180 top
R12  10K  [R0603]  44.32 44.31 90 top
R13  3.24K  [R0603]  45.85 39.36 0 top
R14  10K  [R0603]  8 12.06 180 top
R15  3.24K  [R0603]  12.45 12.06 180 top
R16  4.7K  [R0603]  36.07 15.99 90 top
R17  1K  [R0603]  42.04 44.31 90 top
R18  1K  [R0603]  7.24 6.6 90 top
R19  1K  [R0603]  36.83 34.41 180 top
R20  4.7K  [R0603]  40.39 58.79 270 top
R21  4.7K  [R0603]  42.16 58.79 90 top
R22  4.7K  [R0603]  17.02 11.8 90 top
RESET  -  [Key_SMD_3x4x2]  24.77 25.01 0 top
SW2  -  [Key_SMD_3x4x2]  17.27 38.47 0 top
SWD  A1257WV-S-3P  [CONN-SMD_A1257WV-S-3P]  13.46 60.57 180 top
U1  STM32F446RET6  [LQFP-64_L10.0-W10.0-P0.50-LS12.0-BL]  27.43 36.06 0 top
U2  ESD9B5.0ST5G  [SOD-923_L0.8-W0.6-LS1.0-BI]  29.46 56.13 270 top
U3  ESD9B5.0ST5G  [SOD-923_L0.8-W0.6-LS1.0-BI]  30.23 54.47 90 top
U4  TJA1044GTK/3Z  [HVSON-8_L3.0-W3.0-P0.65-BL-EP]  16.71 33.6 90 top
U5  TJA1044GTK/3Z  [HVSON-8_L3.0-W3.0-P0.65-BL-EP]  39.57 55.25 270 top
U6  CH340N  [SOP-8_L4.9-W3.9-P1.27-LS6.0-BL]  43.31 13.07 0 top
U7  TPS5430DDAR  [ESOP-8_L4.9-W3.9-P1.27-LS6.0-TL-EP]  42.54 33.44 180 top
U8  TPS5430DDAR  [ESOP-8_L4.9-W3.9-P1.27-LS6.0-TL-EP]  12.81 15.65 0 top
U9  AMS1117-3.3  [SOT-89_L4.5-W2.5-P1.50-LS4.2-BR]  37.97 44.44 0 top
UART1  A1257WV-S-3P  [CONN-SMD_A1257WV-S-3P]  32 60.57 180 top
UART2  A1257WV-S-3P  [CONN-SMD_A1257WV-S-3P]  51.69 18.66 90 top
UART3  A1257WV-S-3P  [CONN-SMD_A1257WV-S-3P]  33.78 3.42 0 top
UART4  A1257WV-S-3P  [CONN-SMD_A1257WV-S-3P]  41.78 3.42 0 top
USB1  -  [USB_TYPE-C-16P]  49.91 9.14 90 top
USB2  -  [USB_TYPE-C-16P]  22.86 58.92 180 top
X1  12MHz  [OSC-SMD_4P-L3.2-W2.5-BL]  17.53 28.06 0 top

## Footprints (pads in the part's own frame, mm; a bottom-side part is the same pattern mirrored in y, then rotated)
BUZ-SMD_4P-L8.5-W8.5-P8.50-BR
  rect 2.4x2.4 smd: 1(-3.6,-3.6) 2(3.6,-3.6) 3(3.599,3.599) 4(-3.6,3.6)
C0603
  rect 0.8x0.9 smd: 1(-0.7,0) 2(0.7,0)
C_Ele_SMD_3x5.4mm
  rect 1.999x0.8 smd: 1(1.374,-0.014) 2(-1.364,-0.014)
CONN-SMD_A1257WR-S-2P
  rect 0.6x1.7 smd: 1(0.625,1.6) 2(-0.625,1.6)
  rect 1x2.7 smd: 3(2.575,-1.6) 4(-2.575,-1.6)
CONN-SMD_A1257WR-S-4P
  rect 0.6x1.7 smd: 1(1.875,1.6) 2(0.625,1.6) 3(-0.625,1.6) 4(-1.875,1.6)
  rect 1.3x3 smd: 5(3.825,-1.6) 6(-3.825,-1.6)
CONN-SMD_A1257WV-S-3P
  rect 0.6x1.7 smd: 1(1.25,1.675) 2(0,1.675) 3(-1.25,1.675)
  rect 1x2.8 smd: 4(3.2,-1.675) 5(-3.2,-1.675)
CONN-TH_XT30PW-M
  round 2.5 hole 1.8: 1(-2.5,5) 2(2.5,5)
  round 1.8 hole 1.1: 3(5.5,-5) 4(-5.5,-5)
ESOP-8_L4.9-W3.9-P1.27-LS6.0-TL-EP
  rect 1.3x0.6 smd: 1(-2.7,1.905) 2(-2.7,0.635) 3(-2.7,-0.635) 4(-2.7,-1.905) 5(2.7,-1.905) 6(2.7,-0.635) 7(2.7,0.635) 8(2.7,1.905)
  rect 2.5x3.5 smd: 9(0,0)
HDR-TH_3P-P2.54-V-M-1
  rect 1.575x1.8 hole 1.2: 1(-2.54,0)
  round 1.8 hole 1.2: 2(0,0) 3(2.54,0)
HDR-TH_4P-P2.54-V-M
  rect 1.7x1.7 hole 1.1: 1(-3.81,0)
  round 1.7 hole 1.1: 2(-1.27,0) 3(1.27,0) 4(3.81,0)
HVSON-8_L3.0-W3.0-P0.65-BL-EP
  rect 0.355x0.711 smd: 1(-0.975,-1.433) 2(-0.325,-1.433) 3(0.325,-1.433) 4(0.975,-1.433) 5(0.975,1.433) 6(0.325,1.433) 7(-0.325,1.433) 8(-0.975,1.433)
  rect 2.4x1.6 smd: 9(0,0)
Key_SMD_3x4x2
  rect 1.53x1.36 smd: 1(-2.035,0) 2(2.035,0)
L0603
  rect 0.8x0.864 smd: 1(-0.7,0) 2(0.7,0)
LED0603-RD
  rect 0.8x0.8 smd: 1(-0.799,0) 2(0.799,0)
LED0805-R-RD
  rect 1x1.399 smd: 1(1.05,0) 2(-1.05,0)
LED-SMD_4P-L3.5-W2.8-BR-1
  rect 1.2x0.9 smd: 1(1.5,-0.75) 2(1.5,0.75) 3(-1.5,0.75) 4(-1.5,-0.75)
LQFP-64_L10.0-W10.0-P0.50-LS12.0-BL
  oval 0.3x2 smd: 1(-3.75,-5.75) 2(-3.25,-5.75) 3(-2.75,-5.75) 4(-2.25,-5.75) 5(-1.75,-5.75) 6(-1.25,-5.75) 7(-0.75,-5.75) 8(-0.25,-5.75) 9(0.25,-5.75) 10(0.75,-5.75) 11(1.25,-5.75) 12(1.75,-5.75) 13(2.25,-5.75) 14(2.75,-5.75) 15(3.25,-5.75) 16(3.75,-5.75) 33(3.75,5.75) 34(3.25,5.75) 35(2.75,5.75) 36(2.25,5.75) 37(1.75,5.75) 38(1.25,5.75) 39(0.75,5.75) 40(0.25,5.75) 41(-0.25,5.75) 42(-0.75,5.75) 43(-1.25,5.75) 44(-1.75,5.75) 45(-2.25,5.75) 46(-2.75,5.75) 47(-3.25,5.75) 48(-3.75,5.75)
  oval 2x0.3 smd: 17(5.75,-3.75) 18(5.75,-3.25) 19(5.75,-2.75) 20(5.75,-2.25) 21(5.75,-1.75) 22(5.75,-1.25) 23(5.75,-0.75) 24(5.75,-0.25) 25(5.75,0.25) 26(5.75,0.75) 27(5.75,1.25) 28(5.75,1.75) 29(5.75,2.25) 30(5.75,2.75) 31(5.75,3.25) 32(5.75,3.75) 49(-5.75,3.75) 50(-5.75,3.25) 51(-5.75,2.75) 52(-5.75,2.25) 53(-5.75,1.75) 54(-5.75,1.25) 55(-5.75,0.75) 56(-5.75,0.25) 57(-5.75,-0.25) 58(-5.75,-0.75) 59(-5.75,-1.25) 60(-5.75,-1.75) 61(-5.75,-2.25) 62(-5.75,-2.75) 63(-5.75,-3.25) 64(-5.75,-3.75)
OSC-SMD_4P-L3.2-W2.5-BL
  rect 1.4x1.2 smd: 1(-1.1,-0.875) 2(1.1,-0.875) 3(1.1,0.875) 4(-1.1,0.875)
R0603
  rect 0.806x0.864 smd: 1(-0.753,0) 2(0.753,0)
SMA_L4.3-W2.6-LS5.2-RD
  rect 2x2 smd: 1(-2.2,0) 2(2.2,0)
SMA_L4.4-W2.6-LS5.0-BI
  rect 2x1.8 smd: 1(-2,0) 2(2,0)
SOD-323_L1.8-W1.3-LS2.5-RD
  rect 1x0.75 smd: 1(-1.173,0) 2(1.173,0)
SOD-923_L0.8-W0.6-LS1.0-BI
  rect 0.5x0.4 smd: 1(-0.457,0) 2(0.457,0)
SOIC-8_L4.9-W3.9-P1.27-LS6.0-BL
  oval 0.588x2.045 smd: 1(-1.905,-2.772) 2(-0.635,-2.772) 3(0.635,-2.772) 4(1.905,-2.772) 5(1.905,2.772) 6(0.635,2.772) 7(-0.635,2.772) 8(-1.905,2.772)
SOP-8_L4.9-W3.9-P1.27-LS6.0-BL
  oval 0.63x1.865 smd: 1(-1.905,-2.683) 2(-0.635,-2.683) 3(0.635,-2.683) 4(1.905,-2.683) 5(1.905,2.683) 6(0.635,2.683) 7(-0.635,2.683) 8(-1.905,2.683)
SOT-23-3_L2.9-W1.3-P1.90-LS2.4-BR
  rect 1.25x0.7 smd: 1(1,-0.95) 2(1,0.95) 3(-1,0)
SOT-23-3_L2.9-W1.6-P1.90-LS2.8-BR
  rect 1.07x0.6 smd: 1(1.235,-0.95) 2(1.235,0.95) 3(-1.235,0)
SOT-89_L4.5-W2.5-P1.50-LS4.2-BR
  rect 1.575x0.672 smd: 1(1.356,-1.5) 3(1.356,1.5)
  custom 5.377x1.9 smd: 2(-1.356,0.009)
USB_TYPE-C-16P
  oval 1.2x2 hole 0.7x1.7: 1(-4.193,1.765) 2(4.447,1.765)
  oval 1.2x1.8 hole 0.7x1.4: 3(-4.193,-2.415) 4(4.447,-2.415)
  rect 0.3x1.3 smd: A1(-3.223,2.415) A4(-2.423,2.415) A5(-1.123,2.415) A6(-0.123,2.415) A7(0.377,2.415) A8(1.377,2.415) A9(2.677,2.415) A12(3.477,2.415) B1(3.177,2.415) B4(2.377,2.415) B5(1.877,2.415) B6(0.877,2.415) B7(-0.623,2.415) B8(-1.623,2.415) B9(-2.123,2.415) B12(-2.923,2.415)

## Nets
As in the schematic, except:
GND: C1.2 C2.1 C4.1 C5.1 C6.1 C7.1 C8.1 C9.1 C10.2 C11.2 C12.1 C13.2 C14.1 C15.2 C16.1 C17.1 C18.1 C19.1 C21.2 C22.1 C23.1 C25.2 C26.2 C27.2 CN6.3 CN6.4 CN7.3 CN7.4 CN8.3 CN8.4 CN9.3 CN9.4 CN10.3 CN10.5 CN10.6 CN11.3 CN11.5 CN11.6 CN12.3 CN12.5 CN12.6 CN13.3 CN13.5 CN13.6 CN14.1 CN14.3 CN14.4 D1.3 D2.3 D4.2 D5.2 D6.1 H1.1 H2.1 H3.1 H4.3 LED1.1 LED2.2 LED3.2 LED4.2 LED5.2 Q1.2 Q2.2 R4.2 R13.1 R15.1 R22.1 RESET.1 SWD.1 SWD.4 SWD.5 U1.12 U1.18 U1.31 U1.47 U1.63 U2.1 U3.1 U4.2 U4.8 U4.9 U5.2 U5.8 U5.9 U6.3 U7.6 U7.9 U8.6 U8.9 U9.1 UART1.1 UART1.4 UART1.5 UART2.1 UART2.4 UART2.5 UART3.1 UART3.4 UART3.5 UART4.1 UART4.4 UART4.5 USB1.1 USB1.2 USB1.3 USB1.4 USB1.A1 USB1.A12 USB1.B1 USB1.B12 USB2.1 USB2.2 USB2.3 USB2.4 USB2.A1 USB2.A12 USB2.B1 USB2.B12 X1.2 X1.4
RESET: C1.1 R1.1 RESET.2 U1.7
UART1_RX: Q2.3 R21.1 U1.43 U3.2 UART1.3
UART1_TX: U1.42 U2.2 UART1.2
UART2_RX: U1.17 U6.6 UART2.3
UART2_TX: U1.16 U6.7 UART2.2
UART3_RX: U1.25 UART3.3
UART3_TX: U1.51 UART3.2
UART4_RX: U1.15 UART4.3
UART4_TX: U1.14 UART4.2
$1N2441: R2.2 SWD.2
$1N2467: R3.2 SWD.3

Pads without a net: BUZZER1 3 4; LED1 4; U6 4; U7 2 3 5; U8 2 3 5; USB1 A5 A8 B5 B8; USB2 A5 A8 B5 B8

## Via types
v1: diameter 0.61, hole 0.305, Top Layer to Bottom Layer, 125 vias

## Routing (per net, layer and track width the routed paths; a pad name or vN(x,y) marks a point on that pad's centre or on a via; arc(x,y) is an arc through that point)
5V_U: length 96.8
  Bottom Layer w0.762: H3.2 54.33,14.24 54.33,4.79 53.21,3.68 6.86,3.68 6.1,4.44 v1(6.1,8.87) v1(6.1,11.04) v1(6.1,13.58) 6.1,21.45 H1.2 H2.2
+5V: length 141
  Top Layer w0.305: USB2.A9 20.18,55.5 20.5,55.18 20.76,55.18 v1(20.78,55.2) 20.48,55.49 USB2.B4 ; USB1.B9 46.49,7.01 v1(46.34,6.86) 46.49,6.71 USB1.A4 ; USB1.A9 46.39,11.81 v1(46.37,11.79) 46.65,11.51 USB1.B4 ; USB2.B9 24.98,55.49 v1(25.11,55.37) 25.28,55.54 USB2.A4
  Top Layer w0.508: U4.3 19.08,33.93 v1(19.1,33.91) ; U5.3 37.28,54.92 v1(37.21,54.86)
  Top Layer w0.762: v1(24.49,48.55) 24.77,48.83 R10.1 ; C14.2 42.29,53.46 v1(42.04,53.2) ; v1(32,54.86) C12.2 ; CN10.4 50.09,24.3 v1(50.04,24.25) 50.04,23.49 v1(46.48,19.93) ; CN13.4 50.09,52.24 v1(50.04,52.19) ; v1(50.04,33.52) 50.09,33.57 CN11.4 ; v1(50.04,42.92) 50.09,42.97 CN12.4
  Bottom Layer w0.254: 50.04,42.93 v1(50.04,42.92) ; v1(43.94,46.56) 43.94,46.6
  Bottom Layer w0.762: v1(19.1,33.91) 19.1,45.13 22.52,48.55 v1(24.49,48.55) 25.11,49.16 v1(25.11,55.37) ; 50.04,46.56 50.04,42.93 ; 50.04,46.56 v1(46.4,46.56) 46.36,46.6 43.94,46.6 ; 50.04,46.56 v1(50.04,52.19) ; v1(20.78,55.2) 20.94,55.37 v1(25.11,55.37) ; v1(46.34,6.86) 46.37,6.89 v1(46.37,11.79) 46.37,19.82 v1(46.48,19.93) ; 40.64,62.6 40.64,58.28 v1(37.21,54.86) ; 43.94,46.6 v1(43.94,48.38) 43.94,51.3 v1(42.04,53.2) 38.86,53.2 v1(37.21,54.86) ; 43.94,46.6 v1(41.15,46.6) ; v1(37.21,54.86) v1(32,54.86) 31.49,55.37 v1(25.11,55.37) ; v1(50.04,24.25) v1(50.04,33.52) v1(50.04,42.92)
GND: length 17
  Top Layer w0.762: USB2.A12 18.73,57.16 USB2.2 ; C10.2 19.75,31.3 19.43,30.98 19.43,30.26 19.26,30.09 v1(19.13,30.09) v1(17.45,30.09) v1(15.49,30.09) 15.19,29.79 v1(15.19,28.07) 15.19,26.36 v1(15.51,26.05) v1(17.44,26.05) v1(19.28,26.05) 20.13,25.2 C11.2
  vias: v1(6.85,53.46) v1(6.91,46.86) v1(6.91,40.25) v1(6.92,33.65) v1(7.49,60.06) v1(10.16,50.16) v1(10.16,43.51) v1(10.16,36.95) v1(12.45,36.06) v1(12.99,54.98) v1(13.46,62.24) v1(14.61,8.12) v1(15.37,55.24) v1(15.37,53.97) v1(15.37,47.36) v1(16,5.58) v1(17.4,44.06) v1(19.68,48.12) v1(20.06,5.45) v1(20.95,61.97) v1(22.48,22.98) v1(24.18,61.97) v1(25.02,40.12) v1(25.02,34.16) v1(25.18,5.87) v1(25.27,22.98) v1(28.4,22.98) v1(28.96,34.16) v1(29.84,58.41) v1(30.23,51.17) v1(30.35,6.98) v1(30.99,62.22) v1(30.99,32.38) v1(31.09,22.98) v1(31.62,38.6) v1(32.92,62.22) v1(32.89,49.65) v1(33.78,1.75) v1(34.67,26.92) v1(35.05,56.63) v1(37.75,7.99) v1(38.86,13.96) v1(41.78,1.75) v1(44.45,9.26) v1(47.12,61.84) v1(48.01,1.77) v1(49.13,30.85) v1(49.15,49.27) v1(49.15,40) v1(50.8,61.84) v1(52.32,1.77) v1(53.29,45.84) v1(53.29,36.57) v1(53.29,27.3) v1(53.34,55.49)
VCC3V3: length 183.8
  Top Layer w0.254: LED1.3 31.38,46.49 v1(29.34,44.44) ; v1(24,44.44) 23.68,44.12 U1.48 23.68,40.32 25.2,38.8 30.81,38.8 ; 29.81,32.31 29.68,32.18 U1.13 29.68,28.66 29.2,28.18 R1.2 ; 29.81,32.31 23.68,32.31 ; 29.81,32.31 30.81,33.31 ; U1.64 23.68,32.31 ; 23.68,32.31 U1.1 ; v1(40.13,52.06) 41.01,52.94 U5.5 42.01,54.27 v1(42.04,54.3) ; 37.45,48.4 37.45,46.71 36.62,45.88 U9.2 36.62,42.72 v1(36.62,42.71) ; D3.1 v1(22.23,44.44) 22.23,41.9 21.66,41.34 19.36,41.34 18.16,42.54 17.02,42.54 16.64,42.16 16.64,40.76 16.26,40.38 15.24,40.38 14.99,40.63 14.99,42.92 14.78,43.13 BUZZER1.1 13.29,41.35 12.51,40.57 12.51,38.66 12.77,38.41 C3.1 ; U6.8 41.4,14.34 41.78,13.96 v1(44.83,13.96) 45.21,14.34 U6.5 ; 30.81,38.8 30.81,33.31 ; 30.81,38.8 31.82,39.81 U1.32 ; C3.1 13.33,35.68 14.43,34.58 U4.5 ; C3.1 13.4,38.47 SW2.1 ; 30.81,33.31 U1.19 34.33,33.31 35.43,34.41 R19.2 ; v1(43.43,59.81) 43.17,59.55 R21.2
  Bottom Layer w0.254: 39.11,35.54 C16.2 39.11,34.41 39.63,33.89 C9.2 ; 39.11,35.54 37.86,35.54 36.7,36.69 36.7,38.98 v1(35.05,40.63) 31.24,44.44 ; 39.11,35.54 C13.1 C15.1 C17.2 ; v1(36.62,42.71) 38.14,41.2 C17.2 ; v1(40.13,52.06) 38.86,52.06 31.24,44.44 ; 31.24,44.44 v1(29.34,44.44) v1(24,44.44) ; C17.2 39.11,42.28 39.61,42.78 C4.2 C5.2 C6.2 ; v1(44.83,13.96) 44.83,18.92 43.43,20.31 43.43,26.03 44,26.59 C9.2 ; v1(42.04,54.3) 43.43,55.69 v1(43.43,59.81) ; v1(22.23,44.44) 24,44.44 ; C9.2 C8.2 C7.2
BAT:
  vias: v1(22.48,12.82) v1(22.48,9.84) v1(26.16,18.03) v1(26.16,16.2) v1(26.16,14.31) v1(26.54,12.69) v1(26.54,9.99) v1(30.1,17.26) v1(30.1,14.71) v1(30.1,12.18) v1(30.09,10.41)
BOOT0: length 13.9
  Top Layer w0.254: 19.31,35.93 19.3,35.93 R4.1 ; 19.31,35.93 19.31,35.3 20.29,34.31 U1.60 ; 19.31,35.93 SW2.2 17.65,38.47 16.32,39.81 C3.2
BUZZER: length 5.2
  Top Layer w0.254: U1.50 20.37,39.31 18.42,41.27 17.52,41.27 R11.1
C10: length 3
  Top Layer w0.254: U1.30 34.63,38.81 35.18,39.36 C2.2
CAN1_H: length 38.2
  Top Layer w0.254: 8.76,39.63 8.76,33.27 9.01,33.02 CN9.1 12.05,33.02 12.18,32.89 R6.2 13.98,32.89 14.36,33.28 U4.7 ; 8.76,39.63 CN8.1 ; 8.76,39.63 8.76,46.23 ; CN7.1 8.76,46.23 ; 8.76,46.23 8.76,52.83 ; 8.76,52.83 8.76,54.6 10.09,55.93 D1.2 ; 8.76,52.83 CN6.1
CAN1_L: length 32
  Top Layer w0.254: CN7.2 11.44,47.48 ; 11.44,47.48 11.44,40.88 ; 11.44,47.48 11.44,54.08 ; 11.44,34.27 11.93,34.27 12.06,34.4 R6.1 13.85,34.4 14.32,33.93 U4.6 ; 11.44,34.27 11.44,40.88 ; 11.44,34.27 CN9.2 ; 11.44,54.08 14.14,54.08 D1.1 ; 11.44,54.08 CN6.2 ; CN8.2 11.44,40.88
CAN1_RX: length 3.9
  Top Layer w0.254: U1.61 20.03,33.81 19.26,34.58 U4.4
CAN1_TX: length 3.8
  Top Layer w0.254: U1.62 19.98,33.31 19.3,32.63 U4.1
CAN2_H: length 48.7
  Top Layer w0.254: 51.43,46.46 51.43,28.19 51.17,27.92 CN10.2 ; 51.43,46.46 51.43,55.73 ; 51.43,46.46 CN12.2 ; 51.43,55.73 51.43,58.41 50.61,59.23 D2.2 46.67,59.23 46.23,58.79 46.23,57.52 45.46,56.75 R7.2 43.04,56.75 41.86,55.57 U5.7 ; 51.43,55.73 CN13.2 ; CN11.2 51.43,37.19
CAN2_L: length 43.1
  Top Layer w0.254: D2.1 48.19,57.33 48.42,57.11 48.42,56.98 ; 47.36,57.33 47.36,56.49 46.11,55.25 R7.1 42.68,55.25 42.36,54.92 U5.6 ; 48.42,38.44 48.42,47.71 ; 48.42,38.44 48.42,29.43 48.67,29.17 49.83,29.17 ; 48.42,38.44 CN11.1 ; 48.42,47.71 48.42,56.98 ; 48.42,47.71 CN12.1 ; 48.42,56.98 CN13.1
CAN2_RX: length 18.6
  Top Layer w0.254: U1.33 31.18,43.62 31.75,44.19 32.71,44.19 34.04,45.52 34.04,46.54 arc(34.13,46.77) 34.35,46.86 arc(34.58,46.95) 34.67,47.18 34.67,48.07 arc(34.58,48.29) 34.35,48.39 arc(34.13,48.48) 34.04,48.7 34.04,49.59 arc(34.13,49.82) 34.35,49.91 arc(34.58,50) 34.67,50.23 34.67,51.12 arc(34.58,51.34) 34.35,51.43 arc(34.13,51.53) 34.04,51.75 34.04,52.25 36.06,54.27 U5.4
CAN2_TX: length 18.5
  Top Layer w0.254: U5.1 37.31,56.22 33.53,52.44 33.53,45.58 32.64,44.7 31.68,44.7 30.68,43.69 U1.34
DN: length 5.4
  Top Layer w0.254: USB2.A7 22.48,57.32 22.66,57.5 23.26,57.5 23.48,57.28 USB2.B7 23.48,55.63 23.75,55.36 24.13,55.36 24.39,55.1 R8.1
DP: length 7.6
  Top Layer w0.254: USB2.A6 22.98,55.5 ; 22.98,55.5 22.98,55.49 22.23,55.49 21.98,55.73 USB2.B6 ; 22.98,55.5 23.37,55.11 23.37,53.84 24.77,52.43 R9.1
OLED_SCL: length 27.2
  Top Layer w0.254: U1.29 v1(35.05,38.31)
  Bottom Layer w0.254: v1(35.05,38.31) 35.05,37.76 arc(34.83,37.22) 34.29,37 34.06,37 arc(33.3,36.24) 34.06,35.48 36.05,35.48 arc(36.81,34.71) 36.05,33.95 34.06,33.95 arc(33.3,33.19) 34.06,32.43 34.29,32.43 arc(34.83,32.2) 35.05,31.67 35.05,30.98 H3.3
OLED_SDA: length 27.2
  Top Layer w0.254: U1.53 v1(23.85,37.81)
  Bottom Layer w0.254: v1(23.85,37.81) 31.14,37.81 32.64,36.31 32.64,30.34 39.12,23.87 H3.4
OSC_IN: length 15
  Top Layer w0.203: U1.5 25.68,28.98 25.02,28.31 23.65,28.31 arc(23.11,28.54) 22.88,29.08 22.88,30.32 22.61,30.6 21.97,30.6 21.72,30.34 v1(21.72,28.95) 21.23,28.46 20.57,28.46 ; 20.57,28.46 20.05,28.46 19.57,28.93 X1.3 ; 20.57,28.46 C10.1
  Bottom Layer w0.254: R5.2 20.69,28.95 v1(21.72,28.95)
OSC_OUT: length 15
  Top Layer w0.203: 20.57,28.04 21.56,28.04 v1(21.67,27.93) 25.53,27.93 26.18,28.59 U1.6 ; 20.57,28.04 17.82,28.04 17.53,27.74 17.53,27.42 17.29,27.18 X1.1 ; 20.57,28.04 C11.1
  Bottom Layer w0.254: R5.1 21.29,27.56 v1(21.67,27.93)
RESET: length 9.2
  Top Layer w0.254: U1.7 26.68,25.13 RESET.2 27.05,24.76 28.64,24.76 28.64,26.61 R1.1
RGB: length 5.9
  Top Layer w0.254: LED1.2 28.46,46.49 27.68,45.71 U1.40
SERVO0: length 29.4
  Top Layer w0.254: v1(29.97,39.43) 30.18,39.64 U1.35
  Bottom Layer w0.254: H1.3 13.33,26.15 13.33,28.82 15.59,31.08 18.45,31.08 20.8,33.43 20.8,35.65 24.26,39.11 29.65,39.11 v1(29.97,39.43)
SERVO1: length 29.5
  Top Layer w0.254: U1.36 29.68,40.22 v1(29.21,39.74)
  Bottom Layer w0.254: H2.3 11.94,30.73 12.7,31.49 18.29,31.49 20.4,33.6 20.4,39.18 20.73,39.51 28.98,39.51 v1(29.21,39.74)
SWCLK: length 15
  Top Layer w0.254: R3.1 22.73,52.57 23.24,52.06 23.24,40.38 22.67,39.81 U1.49
SWDIO: length 13.7
  Top Layer w0.254: R2.1 22.48,54.09 23.88,52.7 23.88,46.09 24.68,45.29 U1.46
TTL_DM: length 9.1
  Top Layer w0.254: USB1.A7 48.3,9.51 48.42,9.39 48.42,8.63 48.3,8.5 47.51,8.5 USB1.B7 43.3,8.51 42.67,9.14 U6.2
TTL_DP: length 11.3
  Top Layer w0.254: USB1.B6 46,10.01 45.97,10.04 ; 45.97,10.04 45.97,9.39 46.35,9.01 USB1.A6 ; 45.97,10.04 45.97,11.3 45.34,11.93 41.78,11.93 41.4,11.55 U6.1
UART1_RX: length 29.9
  Top Layer w0.254: R21.1 41.39,58.04 41.27,58.16 41.27,58.67 41.1,58.85 39.06,58.85 38.99,58.92 Q2.3 33.28,58.92 UART1.3 33.25,57.88 30.3,54.93 U3.2 29.82,54.93 v1(28.98,54.09) ; U1.43 26.18,47.64 27.81,49.27 v1(27.81,52.95)
  Bottom Layer w0.254: v1(27.81,52.95) 27.84,52.95 v1(28.98,54.09)
UART1_TX: length 20.3
  Top Layer w0.254: U1.42 26.68,47.38 28.4,49.09 28.4,55.31 28.75,55.67 30.46,55.67 32,57.21 UART1.2
UART2_RX: length 31.9
  Top Layer w0.254: U1.17 31.94,32.31 31.75,32.12 31.75,27.74 33.53,25.96 v1(33.91,25.96) ; UART2.3 48.91,17.41 48.07,18.25 47.35,18.25 arc(47.14,18.17) 47.05,17.95 arc(46.96,17.73) 46.74,17.64 45.83,17.64 arc(45.61,17.73) 45.52,17.95 arc(45.43,18.17) 45.22,18.25 44.23,18.25 43.94,17.97 v1(43.94,17.26) U6.6
  Bottom Layer w0.254: v1(43.94,17.26) 35.24,25.96 v1(33.91,25.96)
UART2_TX: length 32
  Top Layer w0.254: U1.16 31.18,27.36 33.43,25.11 v1(33.94,25.11) ; U6.7 42.66,15.76 v1(42.66,17.26) 44.06,18.66 UART2.2
  Bottom Layer w0.254: v1(42.66,17.26) 41.8,18.13 arc(41.39,18.3) 40.98,18.13 arc(40.57,17.96) 40.16,18.13 39.9,18.38 arc(39.73,18.79) 39.9,19.2 arc(40.07,19.61) 39.9,20.02 39.65,20.28 arc(39.24,20.45) 38.83,20.28 arc(38.41,20.11) 38,20.28 37.75,20.54 arc(37.58,20.95) 37.75,21.36 arc(37.92,21.77) 37.75,22.18 37.49,22.44 arc(37.08,22.61) 36.67,22.44 arc(36.26,22.27) 35.85,22.44 35.59,22.69 arc(35.42,23.1) 35.59,23.51 arc(35.76,23.92) 35.59,24.33 34.82,25.11 v1(33.94,25.11)
UART3_RX: length 39.9
  Top Layer w0.254: UART3.3 32.53,7.25 v1(33.27,7.99) ; U1.25 v1(31.62,36.31)
  Bottom Layer w0.254: v1(31.62,36.31) 27.68,36.31 27.05,35.68 27.05,34.79 33.27,28.57 v1(33.27,7.99)
UART3_TX: length 39.9
  Top Layer w0.254: v1(24.41,36.8) 24.43,36.83 24.43,38.05 23.67,38.81 U1.51 ; v1(33.27,7.1) 33.78,6.6 UART3.2
  Bottom Layer w0.254: v1(33.27,7.1) 32.69,7.69 32.69,28.52 v1(24.41,36.8)
UART4_RX: length 30.4
  Top Layer w0.254: v1(41.07,8.5) 40.53,7.96 UART4.3 ; U1.15 30.68,26.91 33.31,24.28 v1(33.94,24.28)
  Bottom Layer w0.254: v1(41.07,8.5) 41.07,14.99 34.67,21.39 34.67,24 34.38,24.28 v1(33.94,24.28)
UART4_TX: length 30.3
  Top Layer w0.254: UART4.2 41.78,6.82 v1(41.12,7.48) ; U1.14 30.18,26.71 33.39,23.5 v1(33.89,23.5)
  Bottom Layer w0.254: v1(33.89,23.5) 33.89,21.6 40.39,15.11 40.39,8.22 v1(41.12,7.48)
USB_DM: length 13.9
  Top Layer w0.254: U1.44 25.68,47.77 27.3,49.39 27.3,52.19 25.9,53.59 R8.2
USB_DP: length 10.2
  Top Layer w0.254: U1.45 25.18,47.91 26.28,49.01 R10.2 R9.2
$1N2441: length 9.9
  Top Layer w0.254: v1(15.32,57.4) 17.22,55.49 18.29,55.49 19.68,54.09 R2.2 ; v1(13.46,57.38) SWD.2
  Bottom Layer w0.254: v1(15.32,57.4) 15.3,57.38 v1(13.46,57.38)
$1N2467: length 9.8
  Top Layer w0.254: SWD.3 14.73,58.88 14.73,57.14 16.97,54.91 18.11,54.91 18.67,54.35 18.67,53.59 19.68,52.57 R3.2
$1N8795: length 20.6
  Top Layer w0.254: D3.2 21.11,47.9 20.49,47.28 BUZZER1.2 18.84,43.13 18.67,43.3 18.67,52.57 18.29,52.95 Q1.3
$1N9041: length 11.3
  Top Layer w0.254: Q1.1 17.51,46.46 15.88,44.83 R11.2
$1N16702: length 3.5
  Top Layer w0.508: U7.1 46.43,31.54 46.74,31.23 C20.1
$1N16722: length 29.4
  Top Layer w0.508: L1.1 46.61,42.28 47.88,41.01 47.88,28.44 47.43,27.99 C20.2 46.74,27.3 46.1,26.66 40.51,26.66 39.84,27.34 D4.1 39.84,31.53 U7.8
$1N17094: length 10.3
  Top Layer w0.508: U7.4 46.15,35.35 46.6,35.8 R13.2 46.6,40.51 44.32,42.79 R12.1
$1N17486: length 1.8
  Top Layer w0.508: 10.11,17.56 10.11,19.28 C24.1
$1N17488: length 21.3
  Top Layer w0.508: L2.1 7.24,20.31 7.69,20.76 C24.2 10.03,21.96 10.54,22.47 16.55,22.47 17.06,21.96 17.06,18.07 16.55,17.56 15.51,17.56
$1N17512: length 5.8
  Top Layer w0.508: R15.2 R14.1 8.75,13.45 9.06,13.75 10.11,13.75
$1N17679: length 2.3
  Top Layer w0.762: LED2.1 R16.1
$1N17858: length 4.1
  Top Layer w0.508: R17.1 42.04,42.86 42.71,42.19 LED3.1
$1N20132: length 3.4
  Top Layer w0.762: LED4.1 7.25,5.83 R18.1
$1N20230: length 2.3
  Top Layer w0.254: LED5.1 37.58,36.65 R19.1
$1N21122: length 1.6
  Top Layer w0.254: Q2.1 40.32,57.97 R20.2
$1N21124: length 5
  Top Layer w0.254: R20.1 40.39,60.32 40.13,60.57 38.35,60.57 38.1,60.83 38.1,62.6
$1N24808: length 6.9
  Top Layer w0.508: Q3.4 20.99,14.12 20.7,13.83 17.43,13.83 17.02,13.42 R22.2

## Copper pours and planes (outline as drawn; the poured copper is in the pictures)
5V_U on Top Layer: 5.33,15.35 7.71,15.35 7.71,10.91 10.03,10.91 10.03,7.73 8.23,6.85 5.33,6.85
+5V on Top Layer: 47.59,49.77 47.59,44.57 37.97,44.57 37.98,46.86 39.62,46.86 39.62,49.77
GND on Top Layer: -0.13,64 60.58,64 60.58,-0.13 -0.13,-0.13
GND on Bottom Layer: -0.13,64 60.45,64 60.45,-0.13 -0.13,-0.13
VCC on Top Layer: 35.56,33.27 40.49,33.27 40.49,32.28 38.23,32.28 38.23,16.25 30.86,16.25 30.86,19.04 25.15,19.04 25.15,14.72 20.7,14.72 20.7,15.87 14.86,15.87 14.86,16.82 17.63,16.82 17.63,21.58 33.4,21.58 35.56,23.74
BAT on Top Layer: 25.38,18.81 30.62,18.81 30.62,8.92 21.72,8.92 21.72,13.58 25.38,13.58
BAT on Bottom Layer: 25.4,18.81 30.64,18.81 30.64,8.92 21.74,8.92 21.74,13.58 25.4,13.58

Small or netless copper shapes (teardrops, artwork), in the pictures only: 274 on Top Layer, 73 on Bottom Layer
